# EAGLE design inverterboard-v1 (EAGLE 7.1.0)
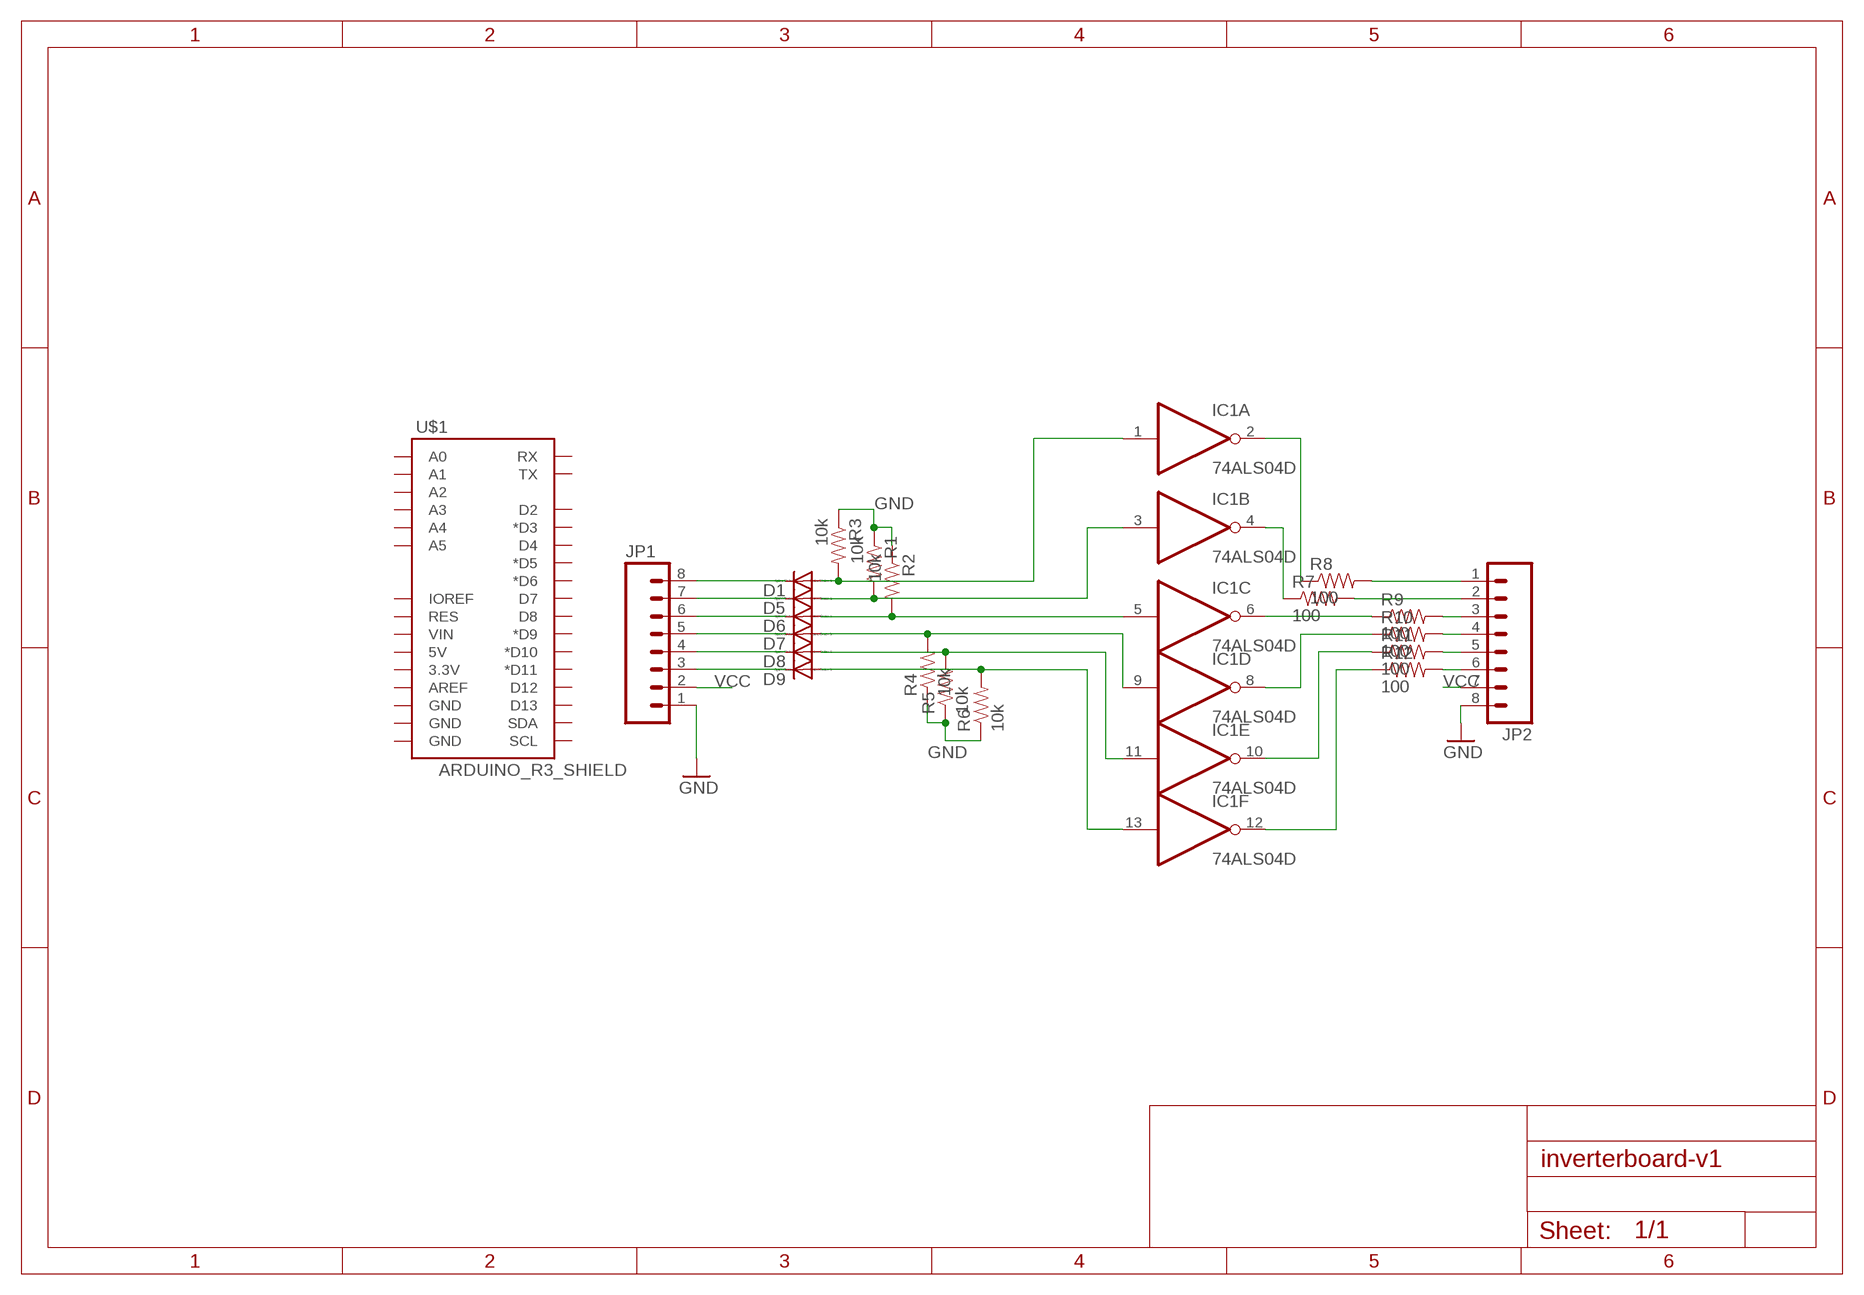
[diagram p0: schematic, sheet 1]

## Parts
D1  DIODE-DO-214AC  [DO-214AC]
D5  DIODE-DO-214AC  [DO-214AC]
D6  DIODE-DO-214AC  [DO-214AC]
D7  DIODE-DO-214AC  [DO-214AC]
D8  DIODE-DO-214AC  [DO-214AC]
D9  DIODE-DO-214AC  [DO-214AC]
IC1  74ALS04D  [SO14]
JP1  M081X08  [1X08]
JP2  M081X08  [1X08]
R1  10k  RESISTOR0603  [0603-RES]
R2  10k  RESISTOR0603  [0603-RES]
R3  10k  RESISTOR0603  [0603-RES]
R4  10k  RESISTOR0603  [0603-RES]
R5  10k  RESISTOR0603  [0603-RES]
R6  10k  RESISTOR0603  [0603-RES]
R7  100  RESISTOR0603  [0603-RES]
R8  100  RESISTOR0603  [0603-RES]
R9  100  RESISTOR0603  [0603-RES]
R10  100  RESISTOR0603  [0603-RES]
R11  100  RESISTOR0603  [0603-RES]
R12  100  RESISTOR0603  [0603-RES]
U$1  ARDUINO_R3_SHIELD  [UNO_R3_SHIELD]

## Nets
GND: JP1.1 JP2.8 R1.1 R2.1 R3.1 R4.1 R5.1 R6.1
N$2: D5.C JP1.7
N$3: JP2.1 R8.2
N$4: D1.C JP1.8
N$10: D6.C JP1.6
N$11: D7.C JP1.5
N$13: D8.C JP1.4
N$14: D9.C JP1.3
N$15: D1.A IC1.1(A:I) R3.2
N$16: D5.A IC1.3(B:I) R1.2
N$17: JP2.2 R7.2
N$18: D7.A IC1.9(D:I) R4.2
N$19: JP2.3 R9.2
N$20: JP2.4 R10.2
N$21: IC1.12(F:O) R12.1
N$22: IC1.10(E:O) R11.1
N$23: IC1.8(D:O) R10.1
N$24: IC1.6(C:O) R9.1
N$25: IC1.4(B:O) R7.1
N$26: IC1.2(A:O) R8.1
N$28: D6.A IC1.5(C:I) R2.2
N$29: JP2.5 R11.2
N$30: D8.A IC1.11(E:I) R5.2
N$31: D9.A IC1.13(F:I) R6.2
N$32: JP2.6 R12.2
VCC: JP1.2 JP2.7
Unconnected: U$1.3.3V U$1.5V U$1.A0 U$1.A1 U$1.A2 U$1.A3 U$1.A4 U$1.A5 U$1.AREF U$1.D2 U$1.D3(*D3) U$1.D4 U$1.D5(*D5) U$1.D6(*D6) U$1.D7 U$1.D8 U$1.D9(*D9) U$1.D10(*D10) U$1.D11(*D11) U$1.D12 U$1.D13 U$1.GND@0(GND) U$1.GND@1(GND) U$1.GND@2(GND) U$1.IOREF U$1.RES U$1.RX U$1.SCL U$1.SDA U$1.TX U$1.VIN

## Power pins joined to a net without a drawn wire
GND: IC1.7(P:GND)
VCC: IC1.14(P:VCC)

## Library data of the parts
D1 D5-D9 = diode:DIODE-: DIODE
IC1 = 74xx-us:74*04: Hex INVERTER
JP1 JP2 = SparkFun-Connectors:M08: Header 8 Standard 8-pin 0.1" header. Use with straight break away headers (SKU : PRT-00116), right angle break away headers (PRT-00553), swiss pins (PRT-00743), machine pins (PRT-00117), and female headers (PRT-00115).
R1-R12 = SparkFun-Resistors:RESISTOR: Resistor Basic schematic elements and footprints for 0603, 1206, and PTH resistors.
U$1 = SparkFun-Boards:ARDUINO_R3_SHIELD: Shield form compatible with the Arduino Uno R3.

## Net classes
1 vcc: width 0.254 mm

## Board
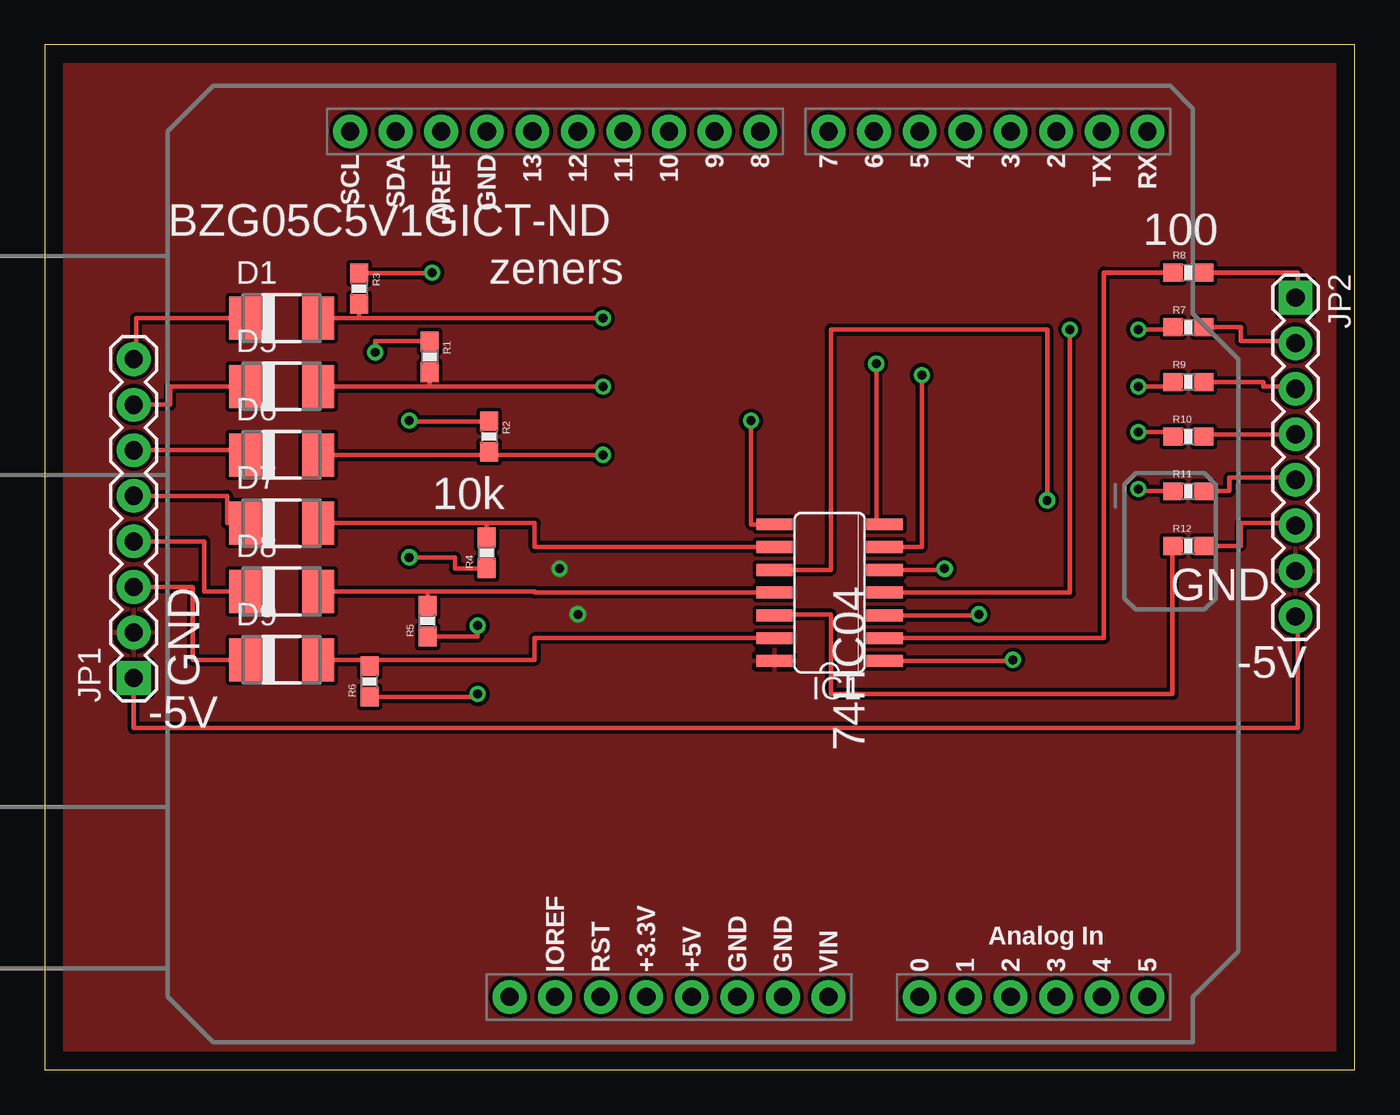
[diagram p1: board, top side]
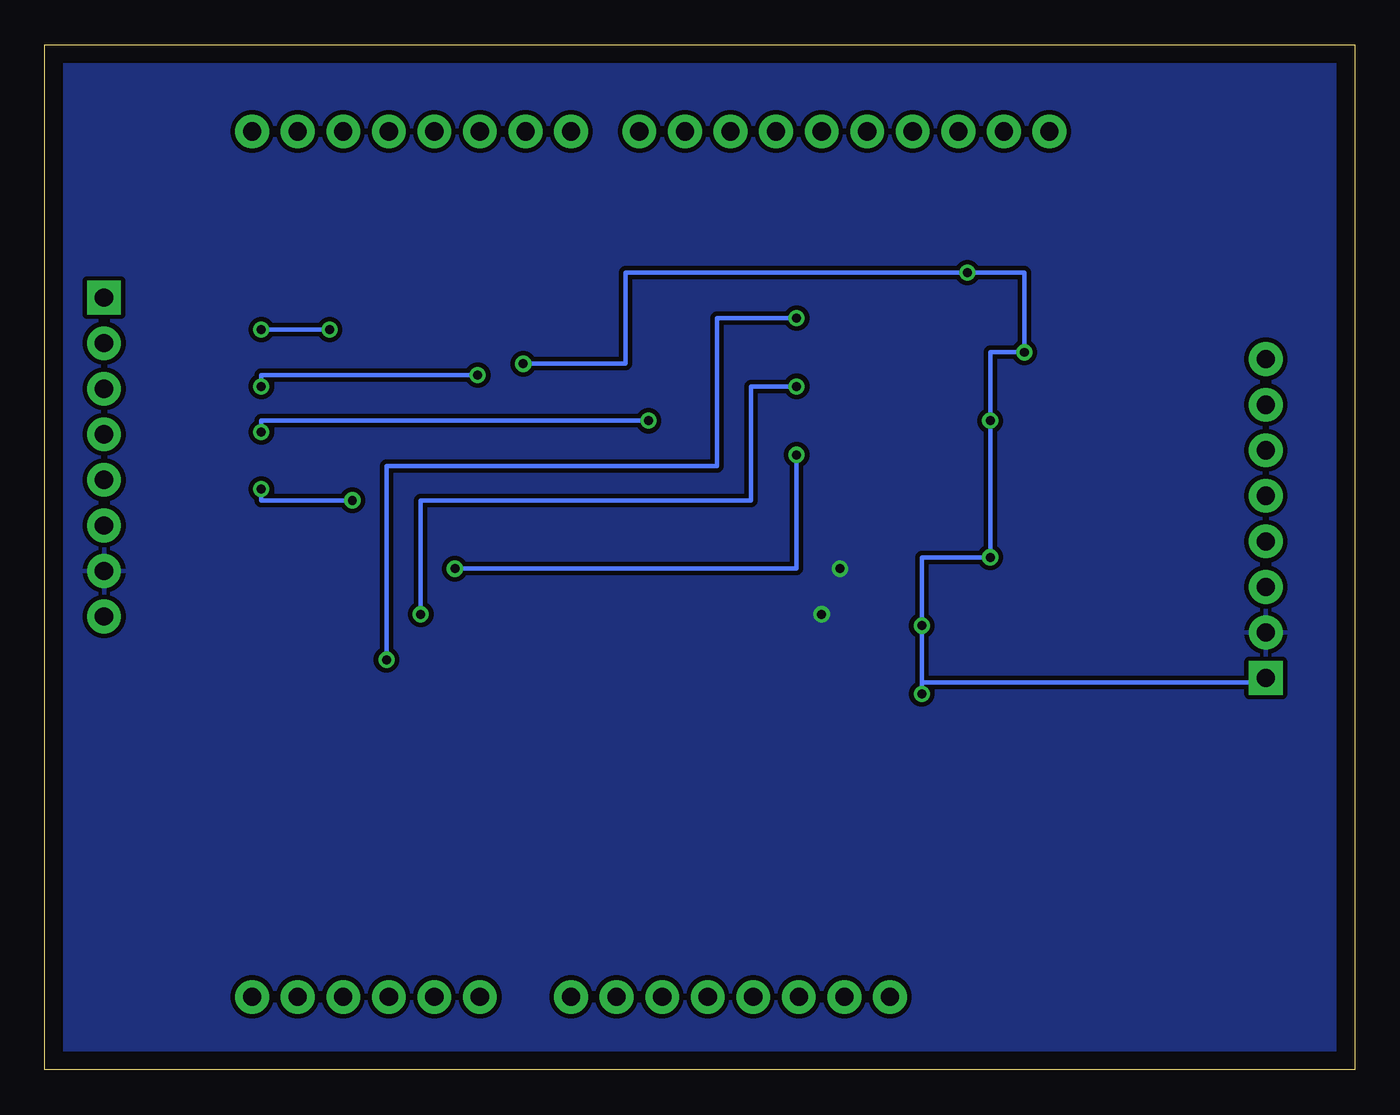
[diagram p2: board, bottom side, seen from below]

Size 73.03 x 57.15 mm. Coordinates in mm from the lower left corner, seen from the top.
Outline: 0,0 73.03,0 73.03,57.15 0,57.15 0,0
Copper layers (1*16): Top 0.035mm / dielectric 1.5mm / Bottom 0.035mm
Design rules "default": minimum track width 10mil, minimum drill 24mil, track to track 8mil, track to pad 8mil, pad to pad 8mil, via to via 8mil, smd to smd 8mil, copper to edge 40mil, drill to drill 8mil, minimum pad ring 10mil, minimum via ring 8mil, stop-mask expansion 4mil, vias tented up to drill 0mil, thermal gap 10mil

### Footprints (pad centres in the part's own frame; a part is rotated, then mirrored left to right if it is on the bottom)
DO-214AC = smd 1.8 x 2.4: A 2.025,0; C -2.025,0
SO14 = smd 0.66 x 2.032: 1 -3.81,-3.073; 2 -2.54,-3.073; 3 -1.27,-3.073; 4 0,-3.073; 5 1.27,-3.073; 6 2.54,-3.073; 7 3.81,-3.073; 8 3.81,3.073; 9 2.54,3.073; 10 1.27,3.073; 11 0,3.073; 12 -1.27,3.073; 13 -2.54,3.073; 14 -3.81,3.073
1X08 = drill 1.016 pad 1.88 square: 1 0,0 | drill 1.016 pad 1.88: 2 2.54,0; 3 5.08,0; 4 7.62,0; 5 10.16,0; 6 12.7,0; 7 15.24,0; 8 17.78,0
0603-RES = smd 1.1 x 1: 1 -0.85,0; 2 0.85,0
UNO_R3_SHIELD = drill 1.016 pad 1.88: 3.3V 50.8,26.67; 5V 50.8,29.21; A0 50.8,41.91; A1 50.8,44.45; A2 50.8,46.99; A3 50.8,49.53; A4 50.8,52.07; A5 50.8,54.61; AREF 2.54,15.24; D2 2.54,49.53; D3 2.54,46.99; D4 2.54,44.45; D5 2.54,41.91; D6 2.54,39.37; D7 2.54,36.83; D8 2.54,33.02; D9 2.54,30.48; D10 2.54,27.94; D11 2.54,25.4; D12 2.54,22.86; D13 2.54,20.32; GND@0 50.8,31.75; GND@1 50.8,34.29; GND@2 2.54,17.78; IOREF 50.8,21.59; NC 50.8,19.05; RES 50.8,24.13; RX 2.54,54.61; SCL 2.54,10.16; SDA 2.54,12.7; TX 2.54,52.07; VIN 50.8,36.83

### Placement (x,y rotation side)
D1  13.21,41.91 0 top
D5  13.21,38.1 0 top
D6  13.21,34.29 0 top
D7  13.21,30.48 0 top
D8  13.21,26.67 0 top
D9  13.21,22.86 0 top
IC1  43.75,26.61 90 top
JP1  4.95,21.84 90 top
JP2  69.72,43.05 270 top
R1  21.46,39.75 270 top
R2  24.77,35.31 270 top
R3  17.53,43.56 270 top
R4  24.64,28.83 90 top
R5  21.34,25.02 90 top
R6  18.1,21.65 90 top
R7  63.75,41.4 0 top
R8  63.75,44.45 0 top
R9  63.75,38.35 0 top
R10  63.75,35.31 0 top
R11  63.75,32.26 0 top
R12  63.75,29.21 0 top
U$1  6.86,54.86 270 top

### Tracks (layer width: path | path; a pad name or v marks a point on that pad's centre or on a via)
GND  (via drill 0.5)
  Top 0.254: R5.1 24.13,24.17 v24.13,24.77 | R6.1 24.13,20.8 v24.13,20.95 | v20.32,28.57 22.86,28.57 22.86,27.94 24.64,27.94 R4.1 | R2.1 20.32,36.16 v20.32,36.2 | v18.41,40.01 18.41,40.64 21.46,40.64 R1.1 | R3.1 21.59,44.41 v21.59,44.45 | JP2.8 69.85,25.27 69.85,19.05 4.95,19.05 JP1.1 | IC1.7 46.35,30.42 v46.35,39.37
  Bottom 0.254: 24.13,21.59 v24.13,24.77 24.13,28.57 v20.32,28.57 v20.32,36.2 20.32,40.01 v18.41,40.01 18.41,44.45 v21.59,44.45 40.64,44.45 40.64,39.37 v46.35,39.37 | 24.13,21.59 4.95,21.59 JP1.1 | v24.13,20.95 24.13,21.59
N$2
  Top 0.254: JP1.7 6.99,37.08 6.99,38.1 D5.C
N$3
  Top 0.254: JP2.1 69.85,43.05 69.85,44.45 R8.2
N$4
  Top 0.254: JP1.8 5.08,39.62 5.08,41.91 D1.C
N$10
  Top 0.254: JP1.6 11.18,34.54 D6.C
N$11
  Top 0.254: JP1.5 10.16,32 10.16,30.48 D7.C
N$13
  Top 0.254: JP1.4 8.89,29.46 8.89,26.67 D8.C
N$14
  Top 0.254: JP1.3 8.25,26.92 8.25,22.86 D9.C
N$15  (via drill 0.5)
  Top 0.254: R3.2 17.53,41.91 D1.A v31.11,41.91 | IC1.1 53.98,22.8 v53.98,22.86
  Bottom 0.254: v53.98,22.86 53.98,33.66 35.56,33.66 35.56,41.91 v31.11,41.91
N$16  (via drill 0.5)
  Top 0.254: R1.2 21.46,38.1 D5.A v31.11,38.1 | IC1.3 52.07,25.34 v52.07,25.4
  Bottom 0.254: v52.07,25.4 52.07,31.75 33.66,31.75 33.66,38.1 v31.11,38.1
N$17
  Top 0.254: R7.2 66.68,41.4 66.68,40.64 69.72,40.64 JP2.2
N$18
  Top 0.254: R4.2 24.64,30.48 D7.A 27.3,30.48 27.3,29.15 IC1.9
N$19
  Top 0.254: R9.2 67.95,38.35 67.95,38.1 69.72,38.1 JP2.3
N$20
  Top 0.254: JP2.4 64.6,35.43 R10.2
N$21
  Top 0.254: R12.1 62.87,29.21 62.87,20.95 43.81,20.95 43.81,25.4 40.68,25.4 IC1.12
N$22  (via drill 0.5)
  Top 0.254: IC1.10 43.81,27.88 43.81,41.27 55.88,41.27 v55.88,31.75 | R11.1 60.96,32.26 v60.96,32.38
  Bottom 0.254: v55.88,31.75 60.96,31.75 v60.96,32.38
N$23  (via drill 0.5)
  Top 0.254: IC1.8 39.37,30.42 v39.37,36.2 | v60.96,35.56 62.9,35.56 R10.1
  Bottom 0.254: v39.37,36.2 60.96,36.2 v60.96,35.56
N$24  (via drill 0.5)
  Top 0.254: IC1.6 48.89,29.15 v48.89,38.73 | v60.96,38.1 62.9,38.1 R9.1
  Bottom 0.254: v48.89,38.73 60.96,38.73 v60.96,38.1
N$25  (via drill 0.5)
  Top 0.254: IC1.4 57.15,26.61 v57.15,41.27 | v60.96,41.27 62.9,41.27 R7.1
  Bottom 0.254: v57.15,41.27 v60.96,41.27
N$26
  Top 0.254: IC1.2 59.05,24.07 59.05,44.45 R8.1
N$28  (via drill 0.5)
  Top 0.254: R2.2 24.77,34.29 D6.A v31.11,34.29 | IC1.5 50.16,27.88 v50.16,27.94
  Bottom 0.254: v50.16,27.94 31.11,27.94 v31.11,34.29
N$29
  Top 0.254: R11.2 66.04,32.26 66.04,33.02 69.72,33.02 JP2.5
N$30
  Top 0.254: R5.2 21.34,26.67 D8.A 27.3,26.67 27.3,26.61 IC1.11
N$31
  Top 0.254: D9.A 18.1,22.86 | 18.1,22.86 R6.2 | 18.1,22.86 27.3,22.86 27.3,24.07 IC1.13
N$32
  Top 0.254: R12.2 66.68,29.21 66.68,30.48 69.72,30.48 JP2.6
VCC  (via drill 0.5)
  other vias: 28.7,27.94 29.72,25.4
  pour Top (isolate 0.152): -3.81,59.18 -3.81,-1.27 74.68,-1.27 74.68,59.44
  pour Bottom (isolate 0.254): -5.08,62.36 -5.08,-5.08 77.98,-5.08 77.98,62.36

### Text on the board
tPlace: BZG05C5V1GICT-ND / zeners | 100 | 10k | GND | GND | -5V | -5V | 74HC04